# Altium schematic sheet main.SchDoc
size A
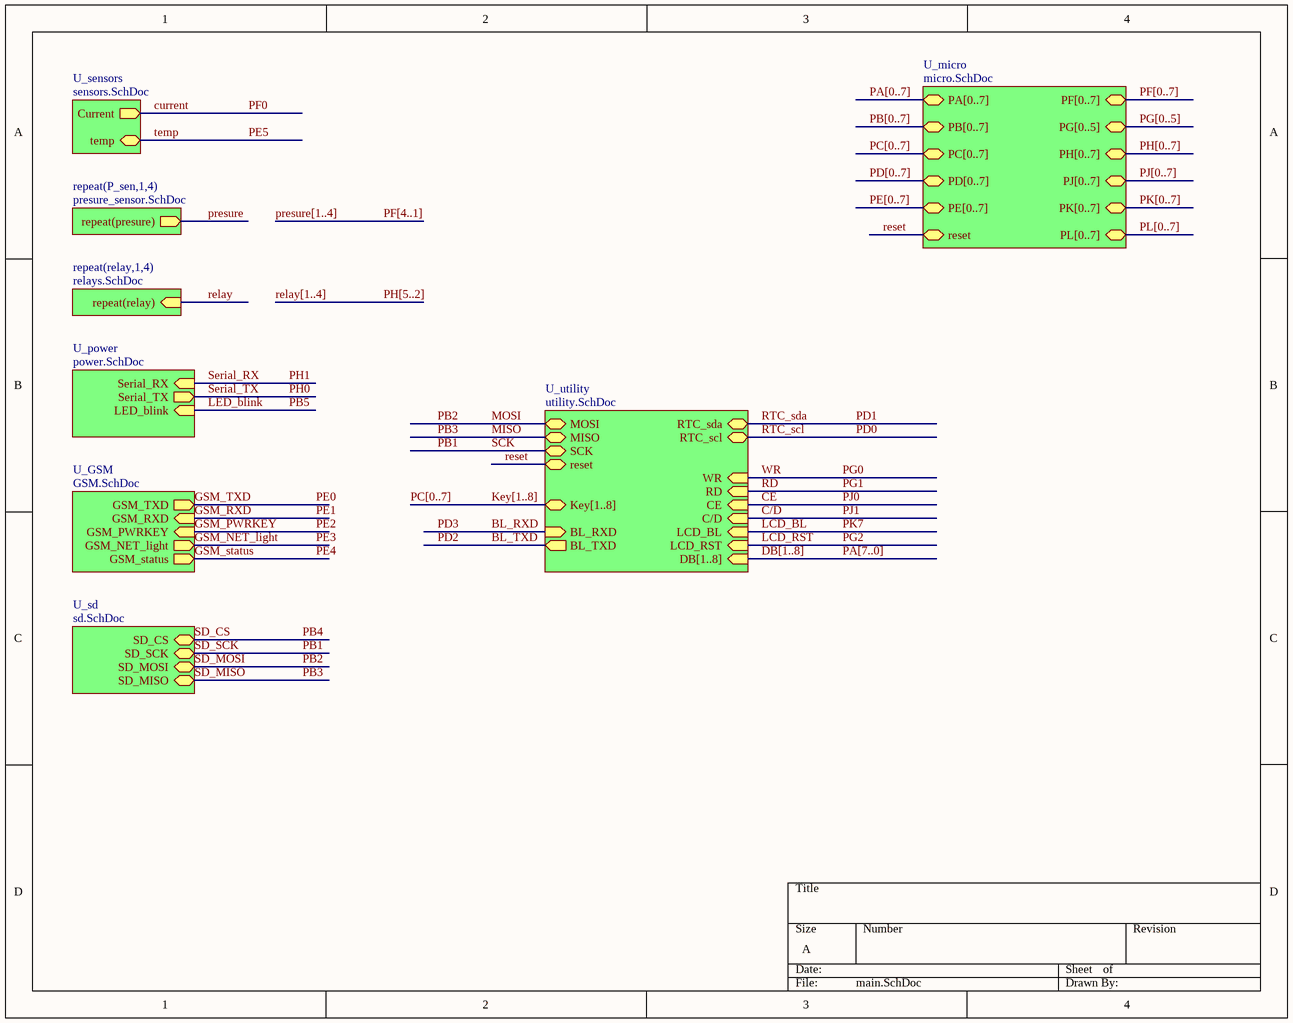
[diagram p0: main.SchDoc]

## Sub-sheets
repeat(P_sen,1,4) = presure_sensor.SchDoc: repeat(presure) (out)
repeat(relay,1,4) = relays.SchDoc: repeat(relay) (in)
U_GSM = GSM.SchDoc: GSM_PWRKEY (in), GSM_RXD (in), GSM_TXD (out), GSM_NET_light (out), GSM_status (out)
U_micro = micro.SchDoc: PE[0..7] (bidir), PH[0..7] (bidir), PB[0..7] (bidir), PL[0..7] (bidir), PD[0..7] (bidir), PG[0..5] (bidir), PC[0..7] (bidir), PJ[0..7] (bidir), PA[0..7] (bidir), PK[0..7] (bidir), PF[0..7] (bidir), reset (bidir)
U_power = power.SchDoc: Serial_RX (in), Serial_TX (out), LED_blink (in)
U_sd = sd.SchDoc: SD_CS (bidir), SD_SCK (bidir), SD_MOSI (bidir), SD_MISO (bidir)
U_sensors = sensors.SchDoc: temp (bidir), Current (out)
U_utility = utility.SchDoc: MOSI (bidir), MISO (bidir), SCK (bidir), reset (bidir), RTC_sda (bidir), RTC_scl (bidir), WR (in), RD (in), CE (in), C/D (in), LCD_RST (in), DB[1..8] (in), Key[1..8] (bidir), BL_RXD (in), BL_TXD (out), LCD_BL (in)

## Nets
BL_RXD: sheet U_utility/BL_RXD  [also labelled PD3]
BL_TXD: sheet U_utility/BL_TXD  [also labelled PD2]
C/D: sheet U_utility/C/D  [also labelled PJ1]
CE: sheet U_utility/CE  [also labelled PJ0]
current: sheet U_sensors/Current  [also labelled PF0]
GSM_NET_light: sheet U_GSM/GSM_NET_light  [also labelled PE3]
GSM_PWRKEY: sheet U_GSM/GSM_PWRKEY  [also labelled PE2]
GSM_RXD: sheet U_GSM/GSM_RXD  [also labelled PE1]
GSM_status: sheet U_GSM/GSM_status  [also labelled PE4]
GSM_TXD: sheet U_GSM/GSM_TXD  [also labelled PE0]
LCD_BL: sheet U_utility/LCD_BL  [also labelled PK7]
LCD_RST: sheet U_utility/LCD_RST  [also labelled PG2]
LED_blink: sheet U_power/LED_blink  [also labelled PB5]
MISO: sheet U_utility/MISO, sheet U_sd/SD_MISO  [also labelled PB3, SD_MISO]
MOSI: sheet U_utility/MOSI, sheet U_sd/SD_MOSI  [also labelled PB2, SD_MOSI]
PB1: sheet U_utility/SCK, sheet U_sd/SD_SCK  [also labelled SCK, SD_SCK]
PB4: sheet U_sd/SD_CS  [also labelled SD_CS]
PD0: sheet U_utility/RTC_scl  [also labelled RTC_scl]
PD1: sheet U_utility/RTC_sda  [also labelled RTC_sda]
PE5: sheet U_sensors/temp  [also labelled temp]
PG0: sheet U_utility/WR  [also labelled WR]
PG1: sheet U_utility/RD  [also labelled RD]
PH0: sheet U_power/Serial_TX  [also labelled Serial_TX]
PH1: sheet U_power/Serial_RX  [also labelled Serial_RX]
presure: sheet repeat(P_sen,1,4)/repeat(presure)
relay: sheet repeat(relay,1,4)/repeat(relay)
reset: sheet U_micro/reset, sheet U_utility/reset

## Buses and harness runs
bus DB[1..8] = PA[7..0] = sheet U_utility/DB[1..8]
bus Key[1..8] = PC[0..7] = sheet U_utility/Key[1..8]
bus PA[0..7] = sheet U_micro/PA[0..7]
bus PB[0..7] = sheet U_micro/PB[0..7]
bus PC[0..7] = sheet U_micro/PC[0..7]
bus PD[0..7] = sheet U_micro/PD[0..7]
bus PE[0..7] = sheet U_micro/PE[0..7]
bus PF[0..7] = sheet U_micro/PF[0..7]
bus PF[4..1] = presure[1..4]
bus PG[0..5] = sheet U_micro/PG[0..5]
bus PH[0..7] = sheet U_micro/PH[0..7]
bus PH[5..2] = relay[1..4]
bus PJ[0..7] = sheet U_micro/PJ[0..7]
bus PK[0..7] = sheet U_micro/PK[0..7]
bus PL[0..7] = sheet U_micro/PL[0..7]